# Altium schematic sheet Coolrunner_JTAG_Power.SchDoc
size A4
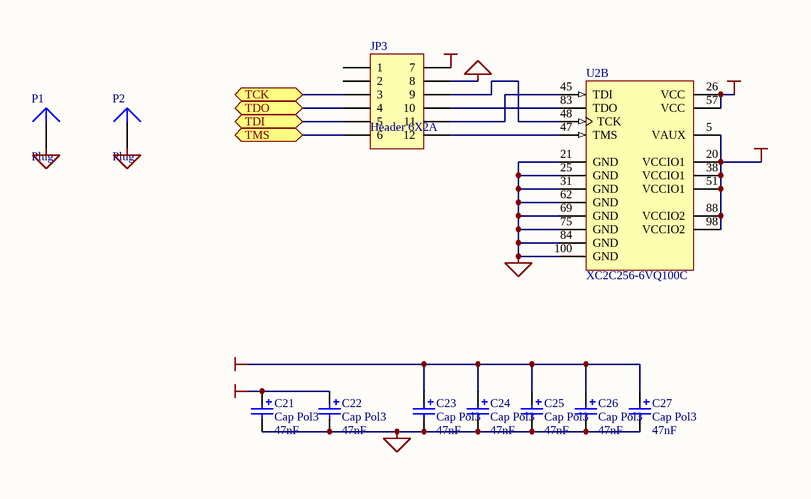
[diagram p0: Coolrunner_JTAG_Power.SchDoc]

## Parts
C21  Cap Pol3  value 47nF  [CAP 10]
C22  Cap Pol3  value 47nF  [CAP 10]
C23  Cap Pol3  value 47nF  [CAP 10]
C24  Cap Pol3  value 47nF  [CAP 10]
C25  Cap Pol3  value 47nF  [CAP 10]
C26  Cap Pol3  value 47nF  [CAP 10]
C27  Cap Pol3  value 47nF  [CAP 10]
JP3  Header 6X2A  [HDR2X6_CEN]
P1  Plug  [PIN1]
P2  Plug  [PIN1]
U2  XC2C256-6VQ100C  [VQ100]  (part B of 2)

## Ports
TCK (bidir), TDI (bidir), TDO (bidir), TMS (bidir)

## Nets
1.8V: C21.1 C22.1 U2.26(VCC) U2.57(VCC)
3.3V: C23.1 C24.1 C25.1 C26.1 C27.1 JP3.7 U2.5(VAUX) U2.20(VCCIO1) U2.38(VCCIO1) U2.51(VCCIO1) U2.88(VCCIO2) U2.98(VCCIO2)
GND: C21.2 C22.2 C23.2 C24.2 C25.2 C26.2 C27.2 JP3.8 P1.1 P2.1 U2.21(GND) U2.25(GND) U2.31(GND) U2.62(GND) U2.69(GND) U2.75(GND) U2.84(GND) U2.100(GND)
TCK: JP3.3 ; port TCK
TDI: JP3.5 ; port TDI
TDO: JP3.4 ; port TDO
TMS: JP3.6 ; port TMS
NetJP3_9: JP3.9 U2.48(TCK)
NetJP3_10: JP3.10 U2.83(TDO)
NetJP3_11: JP3.11 U2.45(TDI)
NetJP3_12: JP3.12 U2.47(TMS)

Not connected (* = marked no-connect by the designer): JP3 1 2

## Library data of the parts
C21-C27 = Cap Pol3: Polarized Capacitor (Surface Mount); Published: 8-Jun-2000; Revision: July-2002: Re-released for DXP Platform.; Publisher: Altium Limited
JP3 = Header 6X2A: Header, 6-Pin, Dual row; Revision: 17-Jul-2002: Re-released for DXP Platform.; Publisher: Altium Limited
U2 = XC2C256-6VQ100C: CoolRunner-II, 1.8V, 256 Macrocell CPLD, 100-Pin VQFP, Commercial Grade; PackageDocument: ver1.2, Jun-2004; Published: 23-Sep-2002; DatasheetDocument: ver2.3, Mar-2005; PackageReference: VQ100; Publisher: Altium Limited; Code_JEDEC: MS-026-AED; Code_IPC: SQFP14X14-100; ComponentLink1Description: Manufacturer Link; ComponentLink1URL: http://www.xilinx.com/xlnx/xil_prodcat_product.jsp?title=cr2_overview; ComponentLink2Description: Datasheet; ComponentLink2URL: http://direct.xilinx.com/bvdocs/publications/ds090.pdf
P1 P2 = Plug: Revision: 17-Jul-2002: Re-released for DXP Platform.; Publisher: Altium Limited